# EAGLE design Remote (EAGLE 9.6.2)
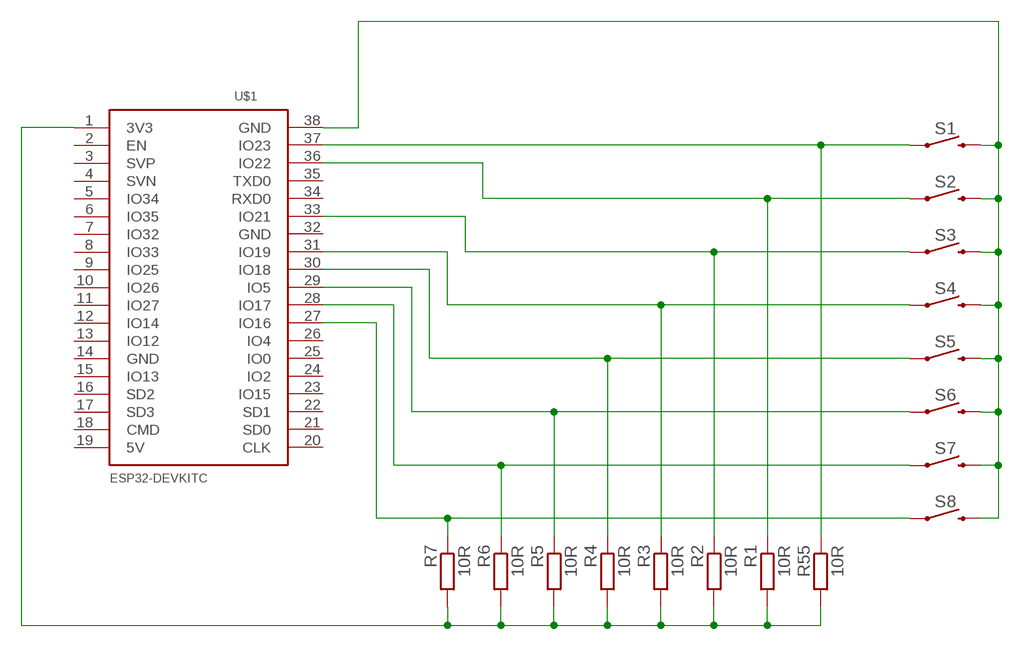
[diagram p0: schematic, sheet 1]

## Parts
R1  10R  R-EU_0204/7  [0204/7]
R2  10R  R-EU_0204/7  [0204/7]
R3  10R  R-EU_0204/7  [0204/7]
R4  10R  R-EU_0204/7  [0204/7]
R5  10R  R-EU_0204/7  [0204/7]
R6  10R  R-EU_0204/7  [0204/7]
R7  10R  R-EU_0204/7  [0204/7]
R55  10R  R-EU_0204/7  [0204/7]
S1  MOMENTARY-SWITCH-SPST-PTH-12MM  [TACTILE_SWITCH_PTH_12MM]
S2  MOMENTARY-SWITCH-SPST-PTH-12MM  [TACTILE_SWITCH_PTH_12MM]
S3  MOMENTARY-SWITCH-SPST-PTH-12MM  [TACTILE_SWITCH_PTH_12MM]
S4  MOMENTARY-SWITCH-SPST-PTH-12MM  [TACTILE_SWITCH_PTH_12MM]
S5  MOMENTARY-SWITCH-SPST-PTH-12MM  [TACTILE_SWITCH_PTH_12MM]
S6  MOMENTARY-SWITCH-SPST-PTH-12MM  [TACTILE_SWITCH_PTH_12MM]
S7  MOMENTARY-SWITCH-SPST-PTH-12MM  [TACTILE_SWITCH_PTH_12MM]
S8  MOMENTARY-SWITCH-SPST-PTH-12MM  [TACTILE_SWITCH_PTH_12MM]
U$1  ESP32NODEMCU  [ESP32NODEMCU]

## Nets
N$1: R55.1 S1.1 U$1.37(IO23)
N$2: R1.1 S2.1 U$1.36(IO22)
N$3: R2.1 S3.1 U$1.33(IO21)
N$4: R3.1 S4.1 U$1.31(IO19)
N$5: R4.1 S5.1 U$1.30(IO18)
N$6: R5.1 S6.1 U$1.29(IO5)
N$7: R6.1 S7.1 U$1.28(IO17)
N$8: R1.2 R2.2 R3.2 R4.2 R5.2 R6.2 R7.2 R55.2 U$1.1(3V3)
N$9: S1.3 S2.3 S3.3 S4.3 S5.3 S6.3 S7.3 S8.3 U$1.38(GND)
N$10: R7.1 S8.1 U$1.27(IO16)
Unconnected: U$1.2(EN) U$1.3(SVP) U$1.4(SVN) U$1.5(IO34) U$1.6(IO35) U$1.7(IO32) U$1.8(IO33) U$1.9(IO25) U$1.10(IO26) U$1.11(IO27) U$1.12(IO14) U$1.13(IO12) U$1.14(GND) U$1.15(IO13) U$1.16(SD2) U$1.17(SD3) U$1.18(CMD) U$1.19(5V) U$1.20(CLK) U$1.21(SD0) U$1.22(SD1) U$1.23(IO15) U$1.24(IO2) U$1.25(IO0) U$1.26(IO4) U$1.32(GND) U$1.34(RXD0) U$1.35(TXD0)

## Library data of the parts
R1-R7 R55 = rcl:R-EU_: RESISTOR, European symbol; SPICEPREFIX: R
S1-S8 = SparkFun-Switches:MOMENTARY-SWITCH-SPST: Momentary Switch (Pushbutton) - SPST Normally-open (NO) SPST momentary switches (buttons, pushbuttons). Variants PTH-12MM - 12mm square, through-hole Momentary Pushbutton Switch - 12mm Square <https://www.sparkfun.com/products/9190> (COM-09190) PTH-6.0MM, PTH-6.0MM-KIT - 6.0mm square, through-hole Mini Pushbutton Switch <https://www.sparkfun.com/products/97> (COM-00097) KIT package intended for soldering kit's - only one side of pads' copper is exposed. PTH-RIGHT-ANGLE-KIT - Right-angle, through-hole Right Angle Tactile Button <https://www.sparkfun.com/products/10791> - Used on SparkFun BigTime Watch Kit <https://www.sparkfun.com/products/11734> SMD-12MM - 12mm square, surface-mount Tactile Button - SMD (12mm) <https://www.sparkfun.com/products/12993> (COM-12993) Used on SparkFun PicoBoard <https://www.sparkfun.com/products/11888> SMD-4.5MM - 4.5mm Square Trackball Switch Used on SparkFun Blackberry Trackballer Breakout <https://www.sparkfun.com/products/13169> SMD-4.6MMX2.8MM - 4.60mm x 2.80mm, surface mount Used on SparkFun SAMD21 Mini Breakout <https://www.sparkfun.com/products/13664> SMD-5.2MM, SMD-5.2-REDUNDANT - 5.2mm square, surface-mount Mini Pushbutton Switch - SMD <https://www.sparkfun.com/products/8720> (COM-08720) Used on Arduino Pro Mini <https://www.sparkfun.com/products/11114> REDUNDANT package connects both switch circuits together SMD-6.0X3.5MM - 6.0 x 3.5mm, surface mount Momentary Reset Switch SMD <https://www.sparkfun.com/products/8229> (COM-08229) SMD-6.2MM-TALL - 6.2mm square, surface mount Tactile Button - SMD (6mm) <https://www.sparkfun.com/products/12992> Used on SparkFun Digital Sandbox <https://www.sparkfun.com/products/12651> SMD-RIGHT-ANGLE - Right-angle, surface mount Used on SparkFun Block for Intel® Edison - Arduino <https://www.sparkfun.com/products/13036>; PROD_ID: SWCH-09185; SF_SKU: COM-09190
U$1 = ESP32-NODEMCU:ESP32NODEMCU

## Net classes
0 default: width 0.203 mm, clearance 0.152 mm

## Board
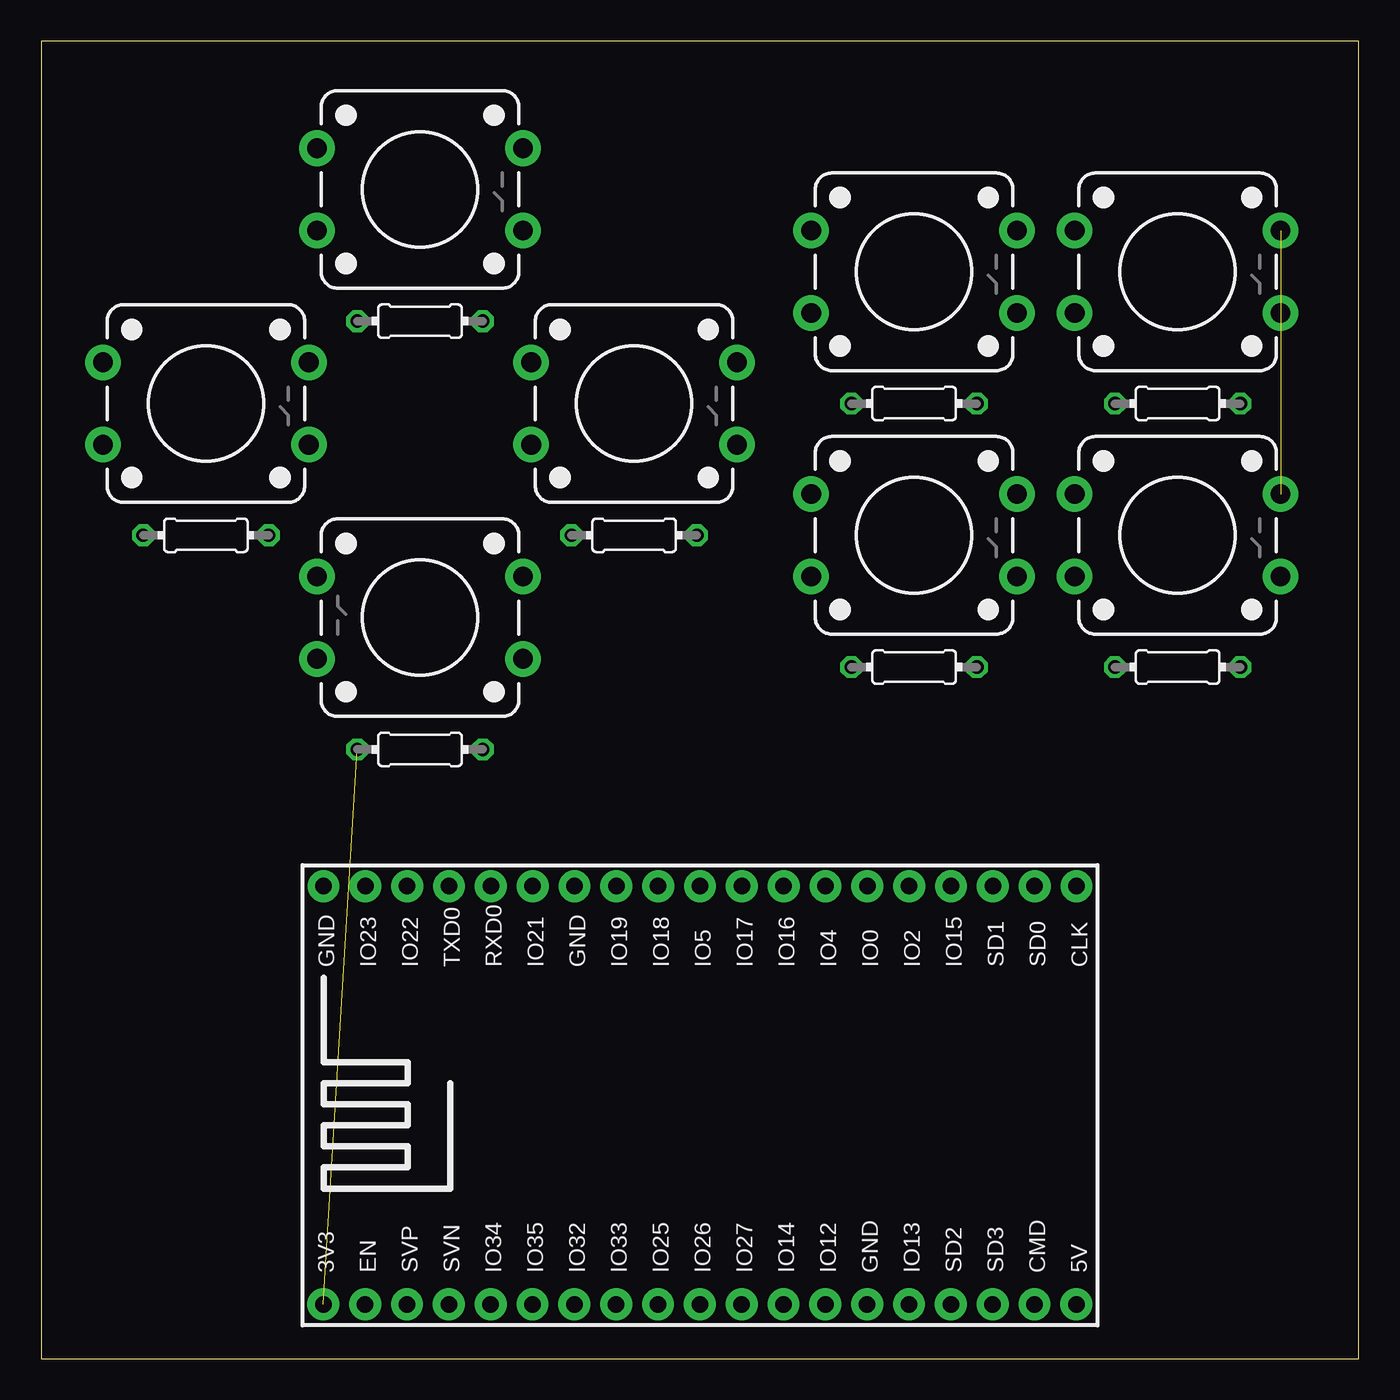
[diagram p1: board, top side]
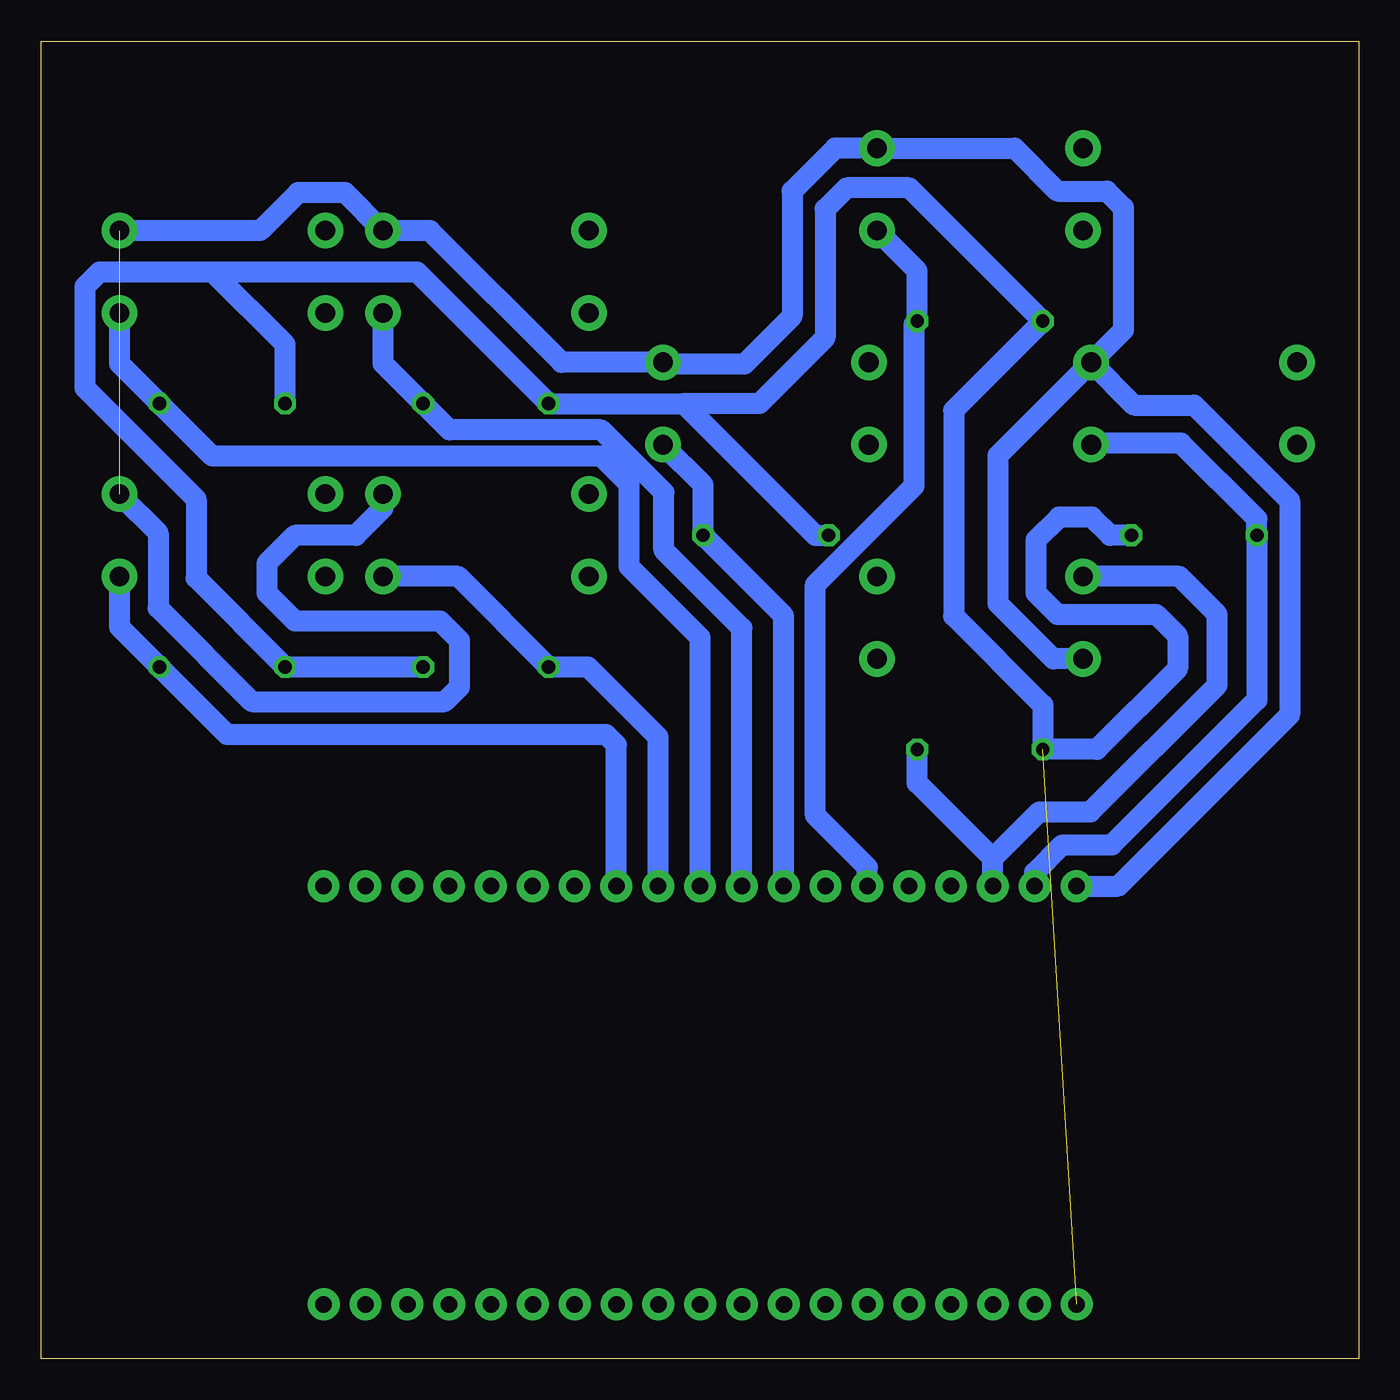
[diagram p2: board, bottom side, seen from below]

Size 80 x 80 mm. Coordinates in mm from the lower left corner, seen from the top.
Outline: 0,0 80,0 80,80 0,80 0,0
Copper layers (1*16): Top 0.035mm / dielectric 1.5mm / Bottom 0.035mm
Design rules "default": minimum track width 6mil, minimum drill 0.35mm, track to track 6mil, track to pad 6mil, pad to pad 6mil, via to via 6mil, smd to smd 6mil, copper to edge 40mil, drill to drill 6mil, minimum pad ring 10mil, minimum via ring 8mil, stop-mask expansion 4mil, vias tented up to drill 0mil, thermal gap 10mil

### Footprints (pad centres in the part's own frame; a part is rotated, then mirrored left to right if it is on the bottom)
0204/7 = drill 0.813 octagon: 1 -3.81,0; 2 3.81,0
TACTILE_SWITCH_PTH_12MM = drill 1.2 pad 2.159: 1 6.25,-2.5; 2 -6.25,-2.5; 3 6.25,2.5; 4 -6.25,2.5
ESP32NODEMCU = drill 1 pad 1.93: 1 -22.87,-12.69; 2 -20.33,-12.69; 3 -17.79,-12.69; 4 -15.25,-12.69; 5 -12.71,-12.69; 6 -10.17,-12.69; 7 -7.63,-12.69; 8 -5.09,-12.69; 9 -2.55,-12.69; 10 -0.01,-12.69; 11 2.53,-12.69; 12 5.07,-12.69; 13 7.61,-12.69; 14 10.15,-12.69; 15 12.69,-12.69; 16 15.23,-12.69; 17 17.77,-12.69; 18 20.31,-12.69; 19 22.85,-12.69; 20 22.86,12.7; 21 20.32,12.7; 22 17.78,12.7; 23 15.24,12.7; 24 12.7,12.7; 25 10.16,12.7; 26 7.62,12.7; 27 5.08,12.7; 28 2.54,12.7; 29 0,12.7; 30 -2.54,12.7; 31 -5.08,12.7; 32 -7.62,12.7; 33 -10.16,12.7; 34 -12.7,12.7; 35 -15.24,12.7; 36 -17.78,12.7; 37 -20.32,12.7; 38 -22.86,12.7

### Placement (x,y rotation side)
R1  23,37 180 top
R2  23,63 180 top
R3  36,50 180 top
R4  53,58 180 top
R5  69,58 180 top
R6  53,42 0 top
R7  69,42 180 top
R55  10,50 0 top
S1  10,58 0 top
S2  23,45 180 top
S3  23,71 0 top
S4  36,58 0 top
S5  53,66 0 top
S6  69,66 0 top
S7  53,50 0 top
S8  69,50 0 top
U$1  40,16 0 top

### Tracks (layer width: path | path; a pad name or v marks a point on that pad's centre or on a via)
N$1
  Bottom 1.27: S1.1 16.35,55.6 10.8,55.6 6.19,50.99 R55.1 6.19,40.01 15,31.2 18,31.2 19.68,29.52 U$1.37
N$2
  Bottom 1.27: U$1.36 22.22,30.38 | 22.22,30.38 19.4,33.2 16.3,33.2 8.6,40.9 8.6,45.2 10.9,47.5 S2.1 | 22.22,30.38 26.81,34.97 R1.1
N$3
  Bottom 1.27: U$1.33 29.84,29.84 33,33 33,47 27,53 27,62.81 R2.1 26.81,66.06 S3.1
N$4
  Bottom 1.27: U$1.31 34.92,45.11 R3.1 39.81,53.06 S4.1
N$5
  Bottom 1.27: U$1.30 37.46,44.36 42.2,49.1 42.2,52.6 46,56.4 55.21,56.4 R4.1 59.25,60.44 S5.1
N$6
  Bottom 1.27: U$1.29 40,43.8 44.3,48.1 44.3,53.1 46,54.8 69.61,54.8 R5.1 75.25,60.44 S6.1
N$7
  Bottom 1.27: U$1.28 42.54,37.74 46.8,42 R6.1 54.69,47.5 S7.1
N$8  (1 unrouted)
  Bottom 1.27: 69.6,66 76.45,66 77.35,65.1 77.35,58.95 70.6,52.2 70.6,47.41 R7.2 R6.2 | 69.6,66 57.19,66 R4.2 41,58 | R5.2 65.19,61.59 69.6,66 | R3.2 33,50 41,58 | 41,58 36.4,58 32.4,62 32.4,69.8 31.1,71.1 27.29,71.1 R2.2 24.6,57.59 24.6,45.1 19.19,39.69 R1.2 15.9,37 11,41.9 11,43.9 12.3,45.2 18.3,45.2 19.6,46.5 19.6,49.7 18.2,51.1 16.2,51.1 15.1,50 R55.2
N$9  (1 unrouted)
  Bottom 1.27: S6.3 66.7,68.5 64.4,70.8 61.55,70.8 S5.3 56.4,68.5 48.4,60.5 S4.3 42.15,60.4 37.3,60.4 34.4,63.3 34.4,70.9 31.8,73.5 S3.3 20.9,73.5 18.3,70.9 15.3,70.9 14.3,69.9 14.3,62.45 S1.3 | S8.3 72.9,50.15 72.9,45.6 67.2,39.9 55.5,39.9 54.6,40.8 54.6,43.6 55.8,44.8 64.6,44.8 66.3,46.5 66.3,48.3 64.6,50 60.9,50 59.25,51.65 S7.3 | S1.3 13.65,57.9 10,57.9 4.2,52.1 4.2,39.1 14.6,28.7 U$1.38 | S2.3 18.55,42.5 21.9,45.85 21.9,54.85 S1.3
N$10
  Bottom 1.27: U$1.27 45.08,37.28 45.7,37.9 68.71,37.9 R7.1 75.25,44.44 S8.1